# EAGLE schematic pixie_bottle_mrk2 (EAGLE 6.4)
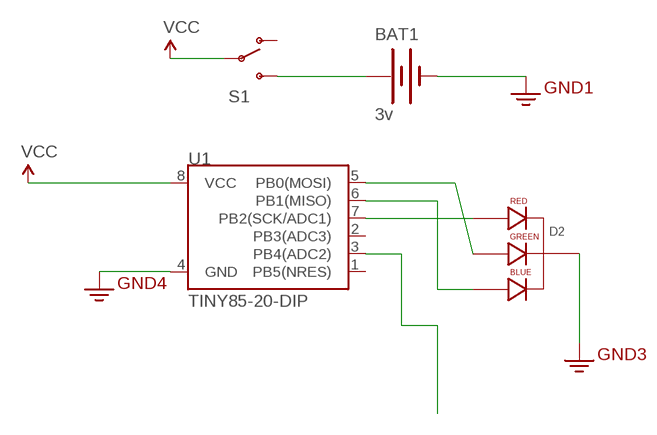
[diagram p0: schematic, sheet 1]

## Parts
BAT1  3v  BATTERY20PTH  [BATTCOM_20MM_PTH]
D2  LED-RGB-CC-THRUDIFFUSE  [LED-RGB-THRU]
S1  SWITCH-SPDTPTH  [SWITCH-SPDT]
U1  TINY85-20-DIP  ATTINY45TINY85-20-DIP  [DIP08]

## Nets
3.3V: BAT1.2(-) D2.2(CATHODE) U1.4(GND) ; supply symbol labelled GND2
N$1: D2.1(RED_CATHODE) U1.7(PB2(SCK/ADC1))
N$2: D2.3(GREEN_CATHODE) U1.5(PB0(MOSI))
N$3: D2.4(BLUE_CATHODE) U1.6(PB1(MISO))
N$4: U1.3(PB4(ADC2))
N$5: BAT1.1(+) S1.3(S)
VCC: S1.2(P) U1.8(VCC)
Unconnected: S1.1(O) U1.1(PB5(NRES)) U1.2(PB3(ADC3))

## Library data of the parts
BAT1 = SparkFun-Electromechanical:BATTERY: Battery Holders Various common sizes : AA, AAA, 20mm coin cell and 12mm coin cell. 20MM_4LEGS, BATT-10373
D2 = SparkFun-LED:LED-RGB-CC-THRU: RGB Through-hole common cathode LED SparkFun Storefront: COM-00105 (Clear) COM-09264 (Diffuse); PROD_ID: DIO-09434
S1 = SparkFun-Electromechanical:SWITCH-SPDT: SPDT Switch Simple slide switch, Spark Fun Electronics SKU : COM-00102 DPDT SMT slide switch, AYZ0202, SWCH-08179
U1 = SparkFun-DigitalIC:ATTINY45: Atmel 8-pin 2/4/8kB flash uC; PROD_ID: IC-09445